# Altium schematic sheet INPUT.SchDoc
size A4
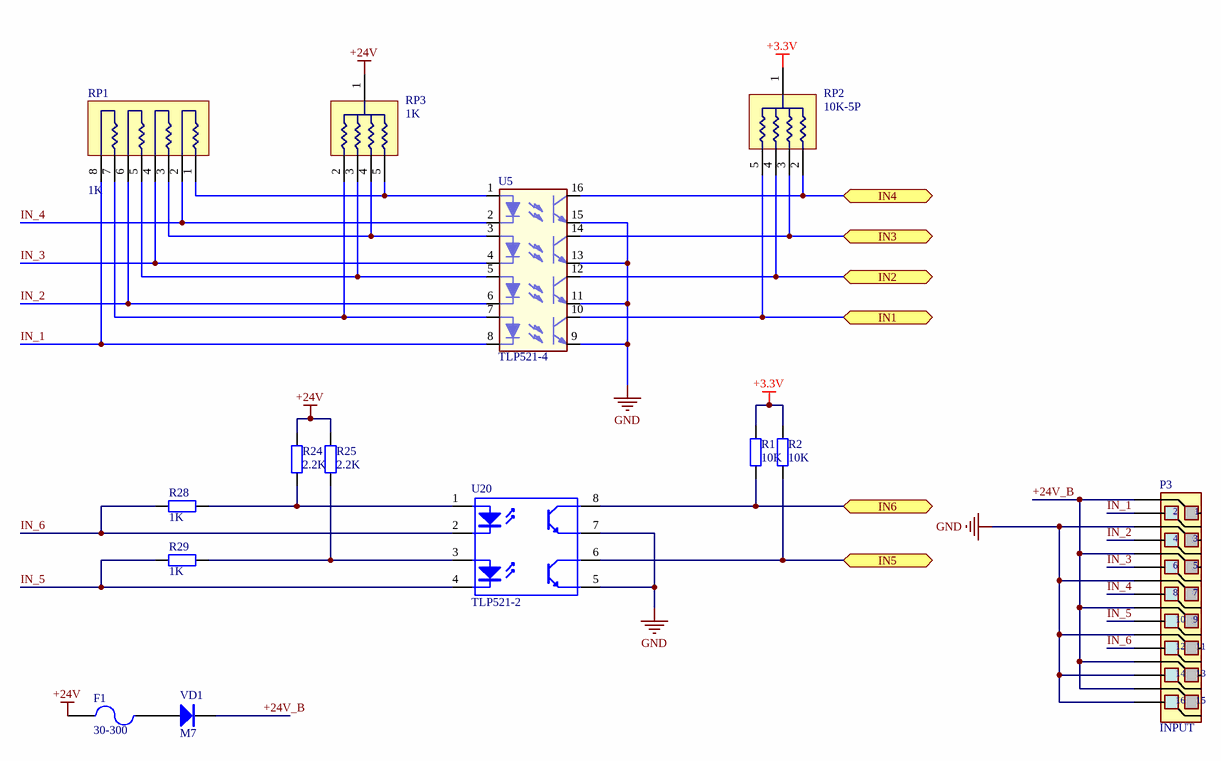
[diagram p0: INPUT.SchDoc]

## Parts
F1  30-300  [FU 1812]
P3  INPUT  [557-2x8]
R1  10K  [R 0805]
R2  10K  [R 0805]
R24  2.2K  [R 0805]
R25  2.2K  [R 0805]
R28  1K  [R 0805]
R29  1K  [R 0805]
RP1  1K  [HDR1X8_1]
RP2  10K-5P  [HDR1X5_1]
RP3  1K  [HDR1X5_1]
U5  TLP521-4  [DIP16-300_MH]
U20  TLP521-2  [DIP8-300_MH]
VD1  M7  [SMA]

## Ports
IN1, IN2, IN3, IN4, IN5, IN6

## Nets
+3.3V: R1.1 R2.1 RP2.1
+24V: F1.1 R24.1 R25.1 RP3.1
GND: P3.3 P3.7 P3.11 P3.14 P3.16 U5.9 U5.11 U5.13 U5.15 U20.5(2E) U20.7(1E)
+24V_B: P3.1 P3.5 P3.9 P3.13 P3.15 VD1.2(K)
IN1: RP2.5 U5.10 ; port IN1
IN2: RP2.4 U5.12 ; port IN2
IN3: RP2.3 U5.14 ; port IN3
IN4: RP2.2 U5.16 ; port IN4
IN5: R2.2 U20.6(2C) ; port IN5
IN6: R1.2 U20.8(1C) ; port IN6
IN_1: P3.2 RP1.8 U5.8
IN_2: P3.4 RP1.6 U5.6
IN_3: P3.6 RP1.4 U5.4
IN_4: P3.8 RP1.2 U5.2
IN_5: P3.10 R29.1 U20.4(2K)
IN_6: P3.12 R28.1 U20.2(1K)
NetF1_2: F1.2 VD1.1(A)
NetR24_2: R24.2 R28.2 U20.1(1A)
NetR25_2: R25.2 R29.2 U20.3(2A)
NetRP1_1: RP1.1 RP3.5 U5.1
NetRP1_3: RP1.3 RP3.4 U5.3
NetRP1_5: RP1.5 RP3.3 U5.5
NetRP1_7: RP1.7 RP3.2 U5.7

## Notes on the sheet
- 设 计
- 制 图
- 审 核
- 类 别
- 签  字
- 日 期
- 产 品
- 名 称
- 零 件
- 板  名
- 数  量
- 共  张
- 第  张
- 批 准
- 文件编号
- 沈阳市创奇游乐设备有限公司

## Library data of the parts
F1 = Fuse 2: Fuse; Published: 8-Jun-2000; LatestRevisionDate: 17-Jul-2002; LatestRevisionNote: Re-released for DXP Platform.; PackageReference: PIN-W2/E2.8; Publisher: Altium Limited
P3 = 557-2x8: 接插件
R1 R2 R24 R25 R28 R29 = Res1
RP1 = Res_Pack4_SIP8
RP2 RP3 = Res4
U5 = OPTOISOLATOR1_4A
U20 = TLP521-2: 2路开关光耦; 版权归属: 源创客; BOM名称: 2路开关光耦; 学习资源: www.ooocke.com
VD1 = M7: 整流二极管; 版权归属: 源创客; BOM名称: 整流二极管; 学习资源: www.ooocke.com